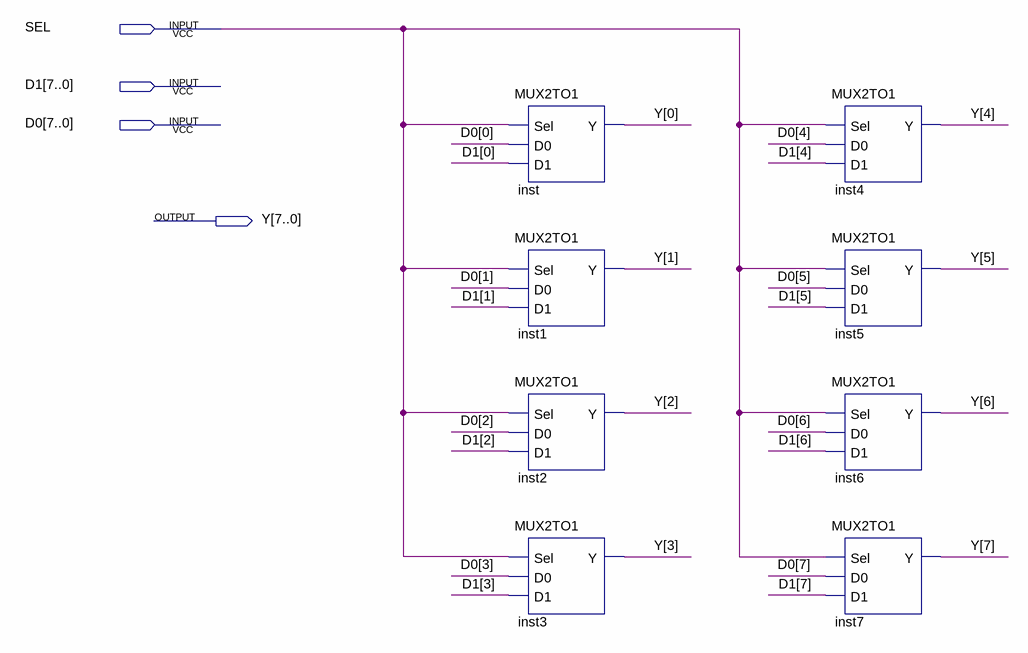
[diagram p0: schematic sheet]
// Quartus schematic MUX2TO1_8BIT.bdf as structural Verilog: 8 symbols, 4 pins
module MUX2TO1_8BIT (
  input  SEL,
  input  [7:0] D1,
  input  [7:0] D0,
  output [7:0] Y
);

  MUX2TO1 inst (.Sel(SEL), .D0(D0[0]), .D1(D1[0]), .Y(Y[0]));
  MUX2TO1 inst1 (.Sel(SEL), .D0(D0[1]), .D1(D1[1]), .Y(Y[1]));
  MUX2TO1 inst2 (.Sel(SEL), .D0(D0[2]), .D1(D1[2]), .Y(Y[2]));
  MUX2TO1 inst3 (.Sel(SEL), .D0(D0[3]), .D1(D1[3]), .Y(Y[3]));
  MUX2TO1 inst4 (.Sel(SEL), .D0(D0[4]), .D1(D1[4]), .Y(Y[4]));
  MUX2TO1 inst5 (.Sel(SEL), .D0(D0[5]), .D1(D1[5]), .Y(Y[5]));
  MUX2TO1 inst6 (.Sel(SEL), .D0(D0[6]), .D1(D1[6]), .Y(Y[6]));
  MUX2TO1 inst7 (.Sel(SEL), .D0(D0[7]), .D1(D1[7]), .Y(Y[7]));
endmodule
